# EAGLE schematic Mic to Pi Entire design (EAGLE 9.6.2)
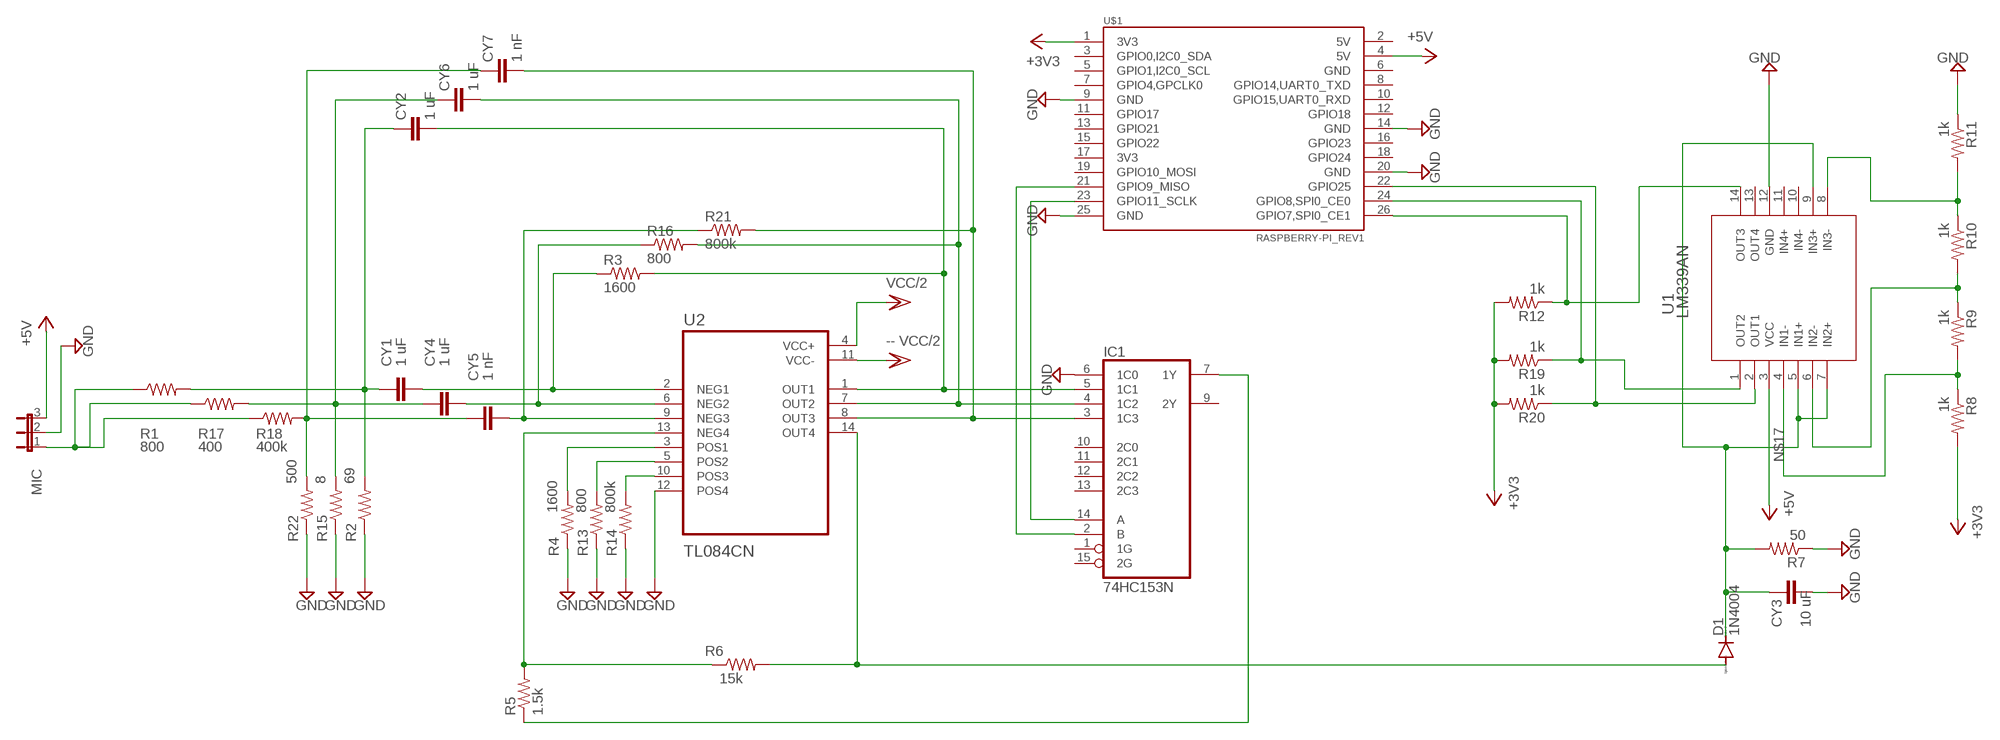
[diagram p0: schematic, sheet 1]

## Parts
CY1  1 uF  CYYC7B5  [YC7B5]
CY2  1 uF  CYYC7B5  [YC7B5]
CY3  10 uF  CYYC7B5  [YC7B5]
CY4  1 uF  CYYC7B5  [YC7B5]
CY5  1 nF  CYYC7B5  [YC7B5]
CY6  1 uF  CYYC7B5  [YC7B5]
CY7  1 nF  CYYC7B5  [YC7B5]
D1  1N4004  [DO41-10]
IC1  74HC153N  [DIL16]
MIC  JP2W  [JP2W]
R1  800  R-US_0204/7  [0204/7]
R2  69  R-US_0204/7  [0204/7]
R3  1600  R-US_0204/7  [0204/7]
R4  1600  R-US_0204/7  [0204/7]
R5  1.5k  R-US_0204/7  [0204/7]
R6  15k  R-US_0204/7  [0204/7]
R7  50  R-US_0204/7  [0204/7]
R8  1k  R-US_0204/7  [0204/7]
R9  1k  R-US_0207/2V  [0207/2V]
R10  1k  R-US_0207/2V  [0207/2V]
R11  1k  R-US_0207/2V  [0207/2V]
R12  1k  R-US_0207/2V  [0207/2V]
R13  800  R-US_0204/7  [0204/7]
R14  800k  R-US_0204/7  [0204/7]
R15  8  R-US_0204/7  [0204/7]
R16  800  R-US_0204/7  [0204/7]
R17  400  R-US_0204/7  [0204/7]
R18  400k  R-US_0204/7  [0204/7]
R19  1k  R-US_0204/7  [0204/7]
R20  1k  R-US_0204/7  [0204/7]
R21  800k  R-US_0204/7  [0204/7]
R22  500  R-US_0204/7  [0204/7]
U1  LM339AN  [PDIP14_646-06_ONS]
U2  TL084CN  [DIP794W45P254L1969H508Q14]
U$1  RASPBERRY-PI_REV1  [RASPBERRY-PI_REV1]

## Nets
+3V3: R8.2 R12.2 R19.2 R20.2 U$1.1(3V3)
+5V: MIC.3 U1.3(VCC) U$1.4(5V)
GND: CY3.2 IC1.6(1C0) MIC.2 R2.1 R4.1 R7.1 R11.1 R13.1 R14.1 R15.1 R22.1 U1.12(GND) U2.12(POS4) U$1.9(GND) U$1.14(GND) U$1.20(GND) U$1.25(GND)
N$1: IC1.7(1Y) R5.1
N$2: R13.2 U2.5(POS2)
N$3: R14.2 U2.10(POS3)
N$4: MIC.1 R1.1 R17.1 R18.1
N$5: CY4.1 CY6.1 R15.2 R17.2
N$6: CY5.1 CY7.1 R18.2 R22.2
N$7: CY4.2 R16.1 U2.6(NEG2)
N$8: CY2.2 IC1.5(1C1) R3.2 U2.1(OUT1)
N$9: CY5.2 R21.1 U2.9(NEG3)
N$10: CY6.2 IC1.4(1C2) R16.2 U2.7(OUT2)
N$11: CY1.1 CY2.1 R1.2 R2.2
N$12: CY1.2 R3.1 U2.2(NEG1)
N$13: R4.2 U2.3(POS1)
N$14: CY7.2 IC1.3(1C3) R21.2 U2.8(OUT3)
N$15: CY3.1 D1.C R7.2 U1.5(IN1+) U1.7(IN2+) U1.9(IN3+)
N$16: R19.1 U1.1(OUT2) U$1.24(GPIO8,SPI0_CE0)
N$17: R8.1 R9.2 U1.4(IN1-)
N$18: R9.1 R10.2 U1.6(IN2-)
N$19: R10.1 R11.2 U1.8(IN3-)
N$20: R20.1 U1.2(OUT1) U$1.22(GPIO25)
N$21: R12.1 U1.14(OUT3) U$1.26(GPIO7,SPI0_CE1)
N$24: R5.2 R6.1 U2.13(NEG4)
N$25: D1.A R6.2 U2.14(OUT4)
N$26: IC1.2(B) U$1.21(GPIO9_MISO)
N$27: IC1.14(A) U$1.23(GPIO11_SCLK)
VCC/2: U2.4(VCC+) U2.11(VCC-) ; supply symbol labelled -- VCC/2
Unconnected: IC1.1(1G) IC1.9(2Y) IC1.10(2C0) IC1.11(2C1) IC1.12(2C2) IC1.13(2C3) IC1.15(2G) U1.10(IN4-) U1.11(IN4+) U1.13(OUT4) U$1.2(5V) U$1.3(GPIO0,I2C0_SDA) U$1.5(GPIO1,I2C0_SCL) U$1.6(GND) U$1.7(GPIO4,GPCLK0) U$1.8(GPIO14,UART0_TXD) U$1.10(GPIO15,UART0_RXD) U$1.11(GPIO17) U$1.12(GPIO18) U$1.13(GPIO21) U$1.15(GPIO22) U$1.16(GPIO23) U$1.17(3V3) U$1.18(GPIO24) U$1.19(GPIO10_MOSI)

## Power pins joined to a net without a drawn wire
GND: IC1.8(GND)
VCC: IC1.16(VCC)

## Library data of the parts
CY1-CY7 = rcl:CY: Y CAPACITOR for power line; SPICEPREFIX: C
D1 = diode:1N4004: DIODE general purpose rectifier, 1 A
IC1 = 74xx-eu:74*153: Dual 4-line to 1-line data SELECTOR/MULTIPLEXER
MIC = jumper:JP2W: JUMPER
R1-R22 = rcl:R-US_: RESISTOR, American symbol; SPICEPREFIX: R
U1 = LM339AN:LM339AN; COPYRIGHT: Copyright (C) 2022 Ultra Librarian. All rights reserved.; DIGI-KEY_PART_NUMBER_1: 2156-LM339AN-HC-ND; DIGI-KEY_PART_NUMBER_2: 2156-LM339AN-ON-ND; DIGI-KEY_PART_NUMBER_3: 296-6605-5-ND; DIGI-KEY_PART_NUMBER_4: 497-1587-5-ND; DIGI-KEY_PART_NUMBER_5: LM339ANFS-ND; MANUFACTURER_PART_NUMBER: LM339AN; MFR_NAME: onsemi
U2 = TL084CN:TL084CN; DESCRIPTION: Quad High Slew Rate JFET-Input Operational Amplifier 14-PDIP 0 to 70; DIGI-KEY_PART_NUMBER: 296-1784-5-ND; MF: Texas Instruments; MP: TL084CN; PACKAGE: PDIP-14 Texas Instruments; PURCHASE-URL: https://pricing.snapeda.com/search/part/TL084CN/?ref=eda
U$1 = RaspberryPi:RASPBERRY-PI_REV1: Raspberry Pi Board <http://www.raspberrypi.org/> Jacques Lagnel V1.0 (beta) 2012 Mateusz Bawaj V1.1 (beta) 2012 Board dimension: Forum 3D model <http://www.raspberrypi.org/forum/general-discussion/mechanical-profile-3d-models?value=3d%20model&type=1&include=1&search=1&ret=all> The GPIO Connector (P1): http://elinux.org/RPi_Low-level_peripherals